# EAGLE schematic Car Controller (EAGLE 9.7.0)
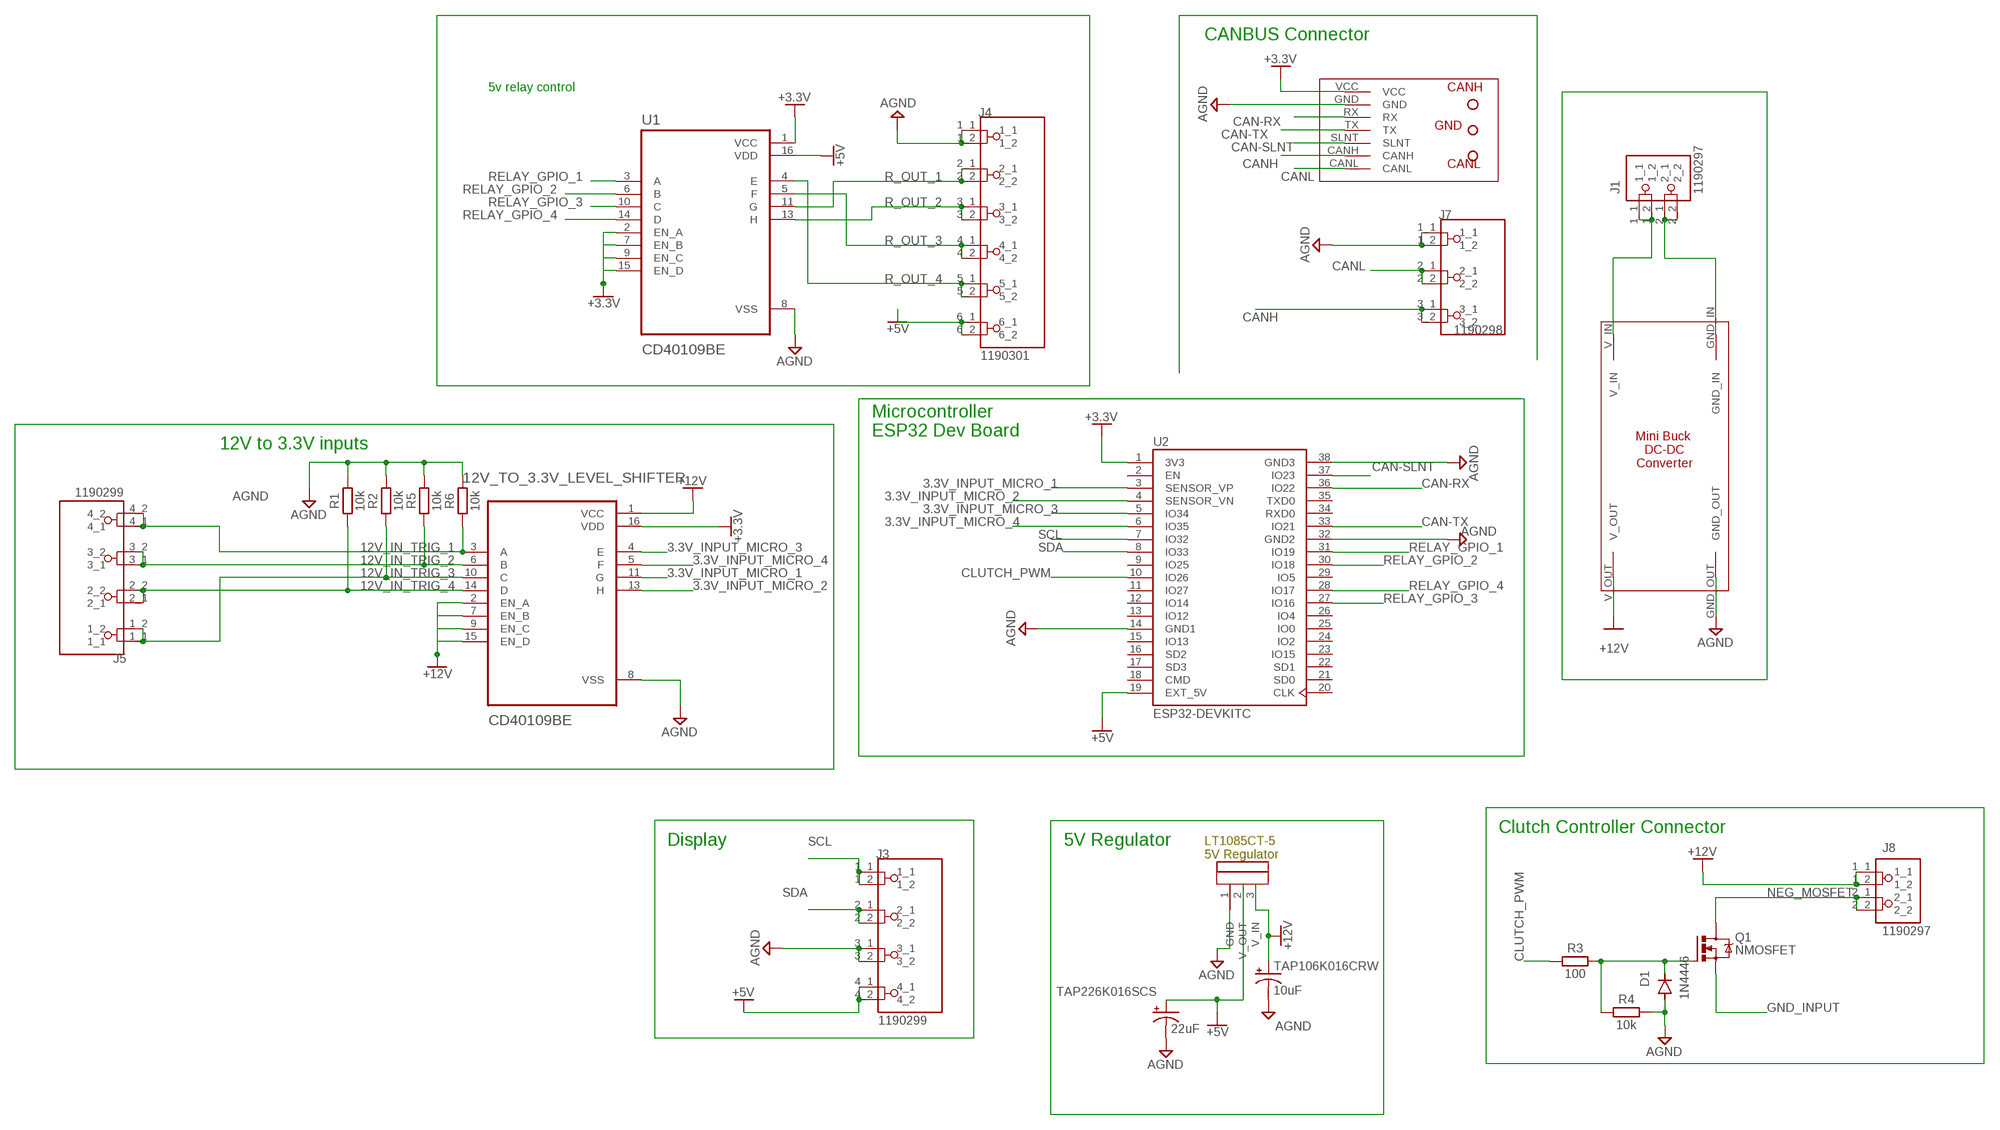
[diagram p0: schematic, sheet 1]

## Parts
12V_TO_3.3V_LEVEL_SHIFTER  CD40109BE  [DIP794W45P254L1969H508Q16]
D1  1N4446  [DO35-10]
J1  1190297  [PHOENIX_1190297]
J3  1190299  [PHOENIX_1190299]
J4  1190301  [PHOENIX_1190301]
J5  1190299  [PHOENIX_1190299]
J7  1190298  [PHOENIX_1190298]
J8  1190297  [PHOENIX_1190297]
Q1  NMOSFET  NMOSFET_TO220  [TO220BV]
R1  10k  R_AXIAL-7.2MM-PITCH  [RESAD724W46L381D178B]
R2  10k  R_AXIAL-7.2MM-PITCH  [RESAD724W46L381D178B]
R3  100  R_AXIAL-7.2MM-PITCH  [RESAD724W46L381D178B]
R4  10k  R_AXIAL-7.2MM-PITCH  [RESAD724W46L381D178B]
R5  10k  R_AXIAL-7.2MM-PITCH  [RESAD724W46L381D178B]
R6  10k  R_AXIAL-7.2MM-PITCH  [RESAD724W46L381D178B]
TAP106K016CRW  10uF  C-POL-US_RADIAL-11MM-DIA  [CAPPRD508W65D1000H1100B]
TAP226K016SCS  22uF  C-POL-US_RADIAL-11MM-DIA  [CAPPRD508W65D1000H1100B]
U1  CD40109BE  [DIP794W45P254L1969H508Q16]
U2  ESP32-DEVKITC  [MODULE_ESP32-DEVKITC]
U$2  MINI_DC-DC_BUCK_CONVERTER  [MINI_BUCK_CONVERTER_FOOTPRINT]
U$3  5V_REG_LT1085CT-5#PBF  [TO253P1067X470X2040-3]
U$8  ADAFRUIT_CANBUS_BREAKOUTBOARD  [CANBUS_PCB_FOOTPRINT]

## Nets
3.3V_INPUT_MICRO_1: 12V_TO_3.3V_LEVEL_SHIFTER.11(G) U2.3(SENSOR_VP)
3.3V_INPUT_MICRO_2: 12V_TO_3.3V_LEVEL_SHIFTER.13(H) U2.4(SENSOR_VN)
3.3V_INPUT_MICRO_3: 12V_TO_3.3V_LEVEL_SHIFTER.4(E) U2.5(IO34)
3.3V_INPUT_MICRO_4: 12V_TO_3.3V_LEVEL_SHIFTER.5(F) U2.6(IO35)
12V_IN_TRIG_1: 12V_TO_3.3V_LEVEL_SHIFTER.3(A) J5.4_1 J5.4_2 R6.2
12V_IN_TRIG_2: 12V_TO_3.3V_LEVEL_SHIFTER.6(B) J5.3_1 J5.3_2 R5.2
12V_IN_TRIG_3: 12V_TO_3.3V_LEVEL_SHIFTER.10(C) J5.1_1 J5.1_2 R2.2
12V_IN_TRIG_4: 12V_TO_3.3V_LEVEL_SHIFTER.14(D) J5.2_1 J5.2_2 R1.2
+3.3V: 12V_TO_3.3V_LEVEL_SHIFTER.16(VDD) U1.1(VCC) U1.2(EN_A) U1.7(EN_B) U1.9(EN_C) U1.15(EN_D) U2.1(3V3) U$8.VCC
+5V: J3.4_1 J3.4_2 J4.6_1 J4.6_2 TAP226K016SCS.1(+) U1.16(VDD) U2.19(EXT_5V) U$3.2(V_OUT)
+12V: 12V_TO_3.3V_LEVEL_SHIFTER.1(VCC) 12V_TO_3.3V_LEVEL_SHIFTER.2(EN_A) 12V_TO_3.3V_LEVEL_SHIFTER.7(EN_B) 12V_TO_3.3V_LEVEL_SHIFTER.9(EN_C) 12V_TO_3.3V_LEVEL_SHIFTER.15(EN_D) J8.1_1 J8.1_2 TAP106K016CRW.1(+) U$2.V_OUT U$3.3(V_IN)
AGND: 12V_TO_3.3V_LEVEL_SHIFTER.8(VSS) D1.A J3.3_1 J3.3_2 J4.1_1 J4.1_2 J7.1_1 J7.1_2 R1.1 R2.1 R4.2 R5.1 R6.1 TAP106K016CRW.2(-) TAP226K016SCS.2(-) U1.8(VSS) U2.14(GND1) U2.32(GND2) U2.38(GND3) U$2.GND_OUT U$3.1(GND) U$8.GND
CAN-RX: U2.36(IO22) U$8.RX
CAN-SLNT: U2.37(IO23) U$8.SLNT
CAN-TX: U2.33(IO21) U$8.TX
CANH: J7.3_1 J7.3_2 U$8.CANH
CANL: J7.2_1 J7.2_2 U$8.CANL
CLUTCH_PWM: R3.1 U2.10(IO26)
GND_INPUT: J1.2_1 J1.2_2 Q1.S U$2.GND_IN
N$11: J1.1_1 J1.1_2 U$2.V_IN
NEG_MOSFET: J8.2_1 J8.2_2 Q1.D
NEG_OF_MOSFET: D1.C Q1.G R3.2 R4.1
R_OUT_1: J4.2_1 J4.2_2 U1.11(G)
R_OUT_2: J4.3_1 J4.3_2 U1.13(H)
R_OUT_3: J4.4_1 J4.4_2 U1.5(F)
R_OUT_4: J4.5_1 J4.5_2 U1.4(E)
RELAY_GPIO_1: U1.3(A) U2.31(IO19)
RELAY_GPIO_2: U1.6(B) U2.30(IO18)
RELAY_GPIO_3: U1.10(C) U2.27(IO16)
RELAY_GPIO_4: U1.14(D) U2.28(IO17)
SCL: J3.1_1 J3.1_2 U2.7(IO32)
SDA: J3.2_1 J3.2_2 U2.8(IO33)
Unconnected: U2.2(EN) U2.9(IO25) U2.11(IO27) U2.12(IO14) U2.13(IO12) U2.15(IO13) U2.16(SD2) U2.17(SD3) U2.18(CMD) U2.20(CLK) U2.21(SD0) U2.22(SD1) U2.23(IO15) U2.24(IO2) U2.25(IO0) U2.26(IO4) U2.29(IO5) U2.34(RXD0) U2.35(TXD0)

## Notes on the sheet
- CANBUS Connector
- 5v relay control
- Microcontroller
  ESP32 Dev Board
- 12V to 3.3V inputs
- Clutch Controller Connector
- Display | 5V Regulator

## Library data of the parts
12V_TO_3.3V_LEVEL_SHIFTER = CD40109BE:CD40109BE
D1 = diode:1N4446: DIODE high speed (Philips)
J1 J8 = SnapEDA Library:1190297; MANUFACTURER: Phoenix Contact; MAXIMUM_PACKAGE_HEIGHT: 23.58mm; PARTREV: 03.11.2020; STANDARD: Manufacturer Recommendations
J3 J5 = SnapEDA Library:1190299; MANUFACTURER: PHOENIX
J4 = SnapEDA Library:1190301; MANUFACTURER: PHOENIX
J7 = SnapEDA Library:1190298; MANUFACTURER: PHOENIX
Q1 = Transistor:NMOSFET: N-Channel MOSFET - Generic; CATEGORY: Transistor; SUB-CATEGORY: MOSFET; TYPE: N-Channel
R1-R6 = Resistor:R: Resistor Fixed - Generic; CATEGORY: Resistor; SUB-CATEGORY: Fixed
TAP106K016CRW TAP226K016SCS = Capacitor:C-POL-US: Capacitor Polarised - ANSI; CATEGORY: Capacitor
U1 = SnapEDA Library:CD40109BE
U2 = SnapEDA Library:ESP32-DEVKITC: ESP32-DEVKITC; MANUFACTURER: ESPRESSIF; PARTREV: N/A; STANDARD: Manufacturer Recommendations
U$2 = Buck Converter Symbol:MINI_DC-DC_BUCK_CONVERTER
U$3 = 5V Regulator - LT1085CT-5_PBF:5V_REG_LT1085CT-5#PBF
U$8 = CANBUS Component:ADAFRUIT_CANBUS_BREAKOUTBOARD